# Altium schematic sheet E-01-MB.SchDoc: E-01-MB
size A4; DrawnBy: Wahyu Mahardika; Engineer: Wahyu Mahardika; Organization: EPROM; Address1: Teknik Elektro; Address2: PNUP; Address3: Makassar; Address4: Indonesia; DocumentNumber: 1; Revision: 1
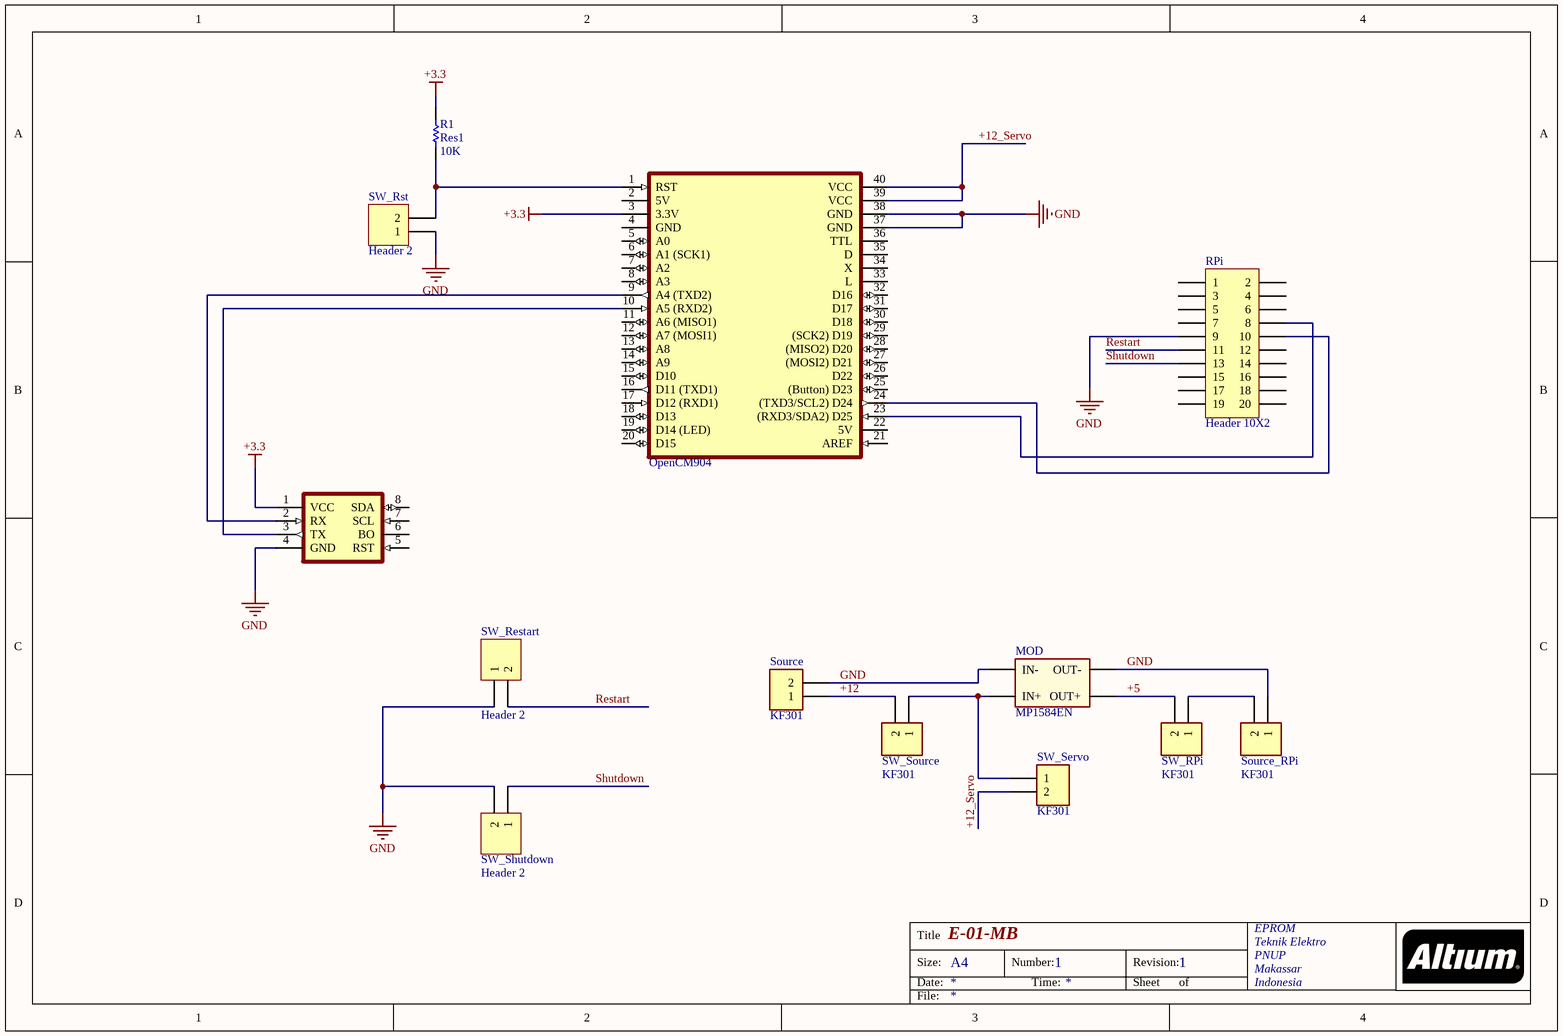
[diagram p0: E-01-MB.SchDoc]

## Parts
GY-Sensor  GY25  [GY25]  (value not drawn)
Main  OpenCM904  [OpenCM904-DIP40]
MOD  MP1584EN  [PCBComponent_1]
R1  Res1  value 10K  [AXIAL-0.3]
RPi  Header 10X2  [HDR2X10]
Source  KF301  [KF301]
Source_RPi  KF301  [KF301]
SW_Restart  Header 2  [HDR1X2]
SW_RPi  KF301  [KF301]
SW_Rst  Header 2  [HDR1X2]
SW_Servo  KF301  [KF301]
SW_Shutdown  Header 2  [HDR1X2]
SW_Source  KF301  [KF301]

## Nets
+3.3: GY-Sensor.1(VCC) Main.3(3.3V) R1.2
GND: GY-Sensor.4(GND) Main.37(GND) Main.38(GND) MOD.1(IN-) MOD.3(OUT-) RPi.9 Source.2 Source_RPi.1 SW_Restart.1 SW_Rst.1 SW_Shutdown.2
+5: MOD.4(OUT+) SW_RPi.2
+12: Source.1 SW_Source.2
+12_Servo: Main.39(VCC) Main.40(VCC) SW_Servo.2
Restart: RPi.11 SW_Restart.2
Shutdown: RPi.13 SW_Shutdown.1
NetGY-Sensor_2: GY-Sensor.2(RX) Main.9(A4_(TXD2))
NetGY-Sensor_3: GY-Sensor.3(TX) Main.10(A5_(RXD2))
NetMain_1: Main.1(RST) R1.1 SW_Rst.2
NetMain_23: Main.23((RXD3/SDA2)_D25) RPi.8
NetMain_24: Main.24((TXD3/SCL2)_D24) RPi.10
NetMOD_2: MOD.2(IN+) SW_Servo.1 SW_Source.1
NetSource_RPi_2: Source_RPi.2 SW_RPi.1

Not connected (* = marked no-connect by the designer): GY-Sensor 5(RST) 6(BO) 7(SCL) 8(SDA); Main 2(5V) 4(GND) 5(A0) 6(A1_(SCK1)) 7(A2) 8(A3) 11(A6_(MISO1)) 12(A7_(MOSI1)) 13(A8) 14(A9) 15(D10) 16(D11_(TXD1)) 17(D12_(RXD1)) 18(D13) 19(D14_(LED)) 20(D15) 21(AREF) 22(5V) 25((Button)_D23) 26(D22) 27((MOSI2)_D21) 28((MISO2)_D20) 29((SCK2)_D19) 30(D18) 31(D17) 32(D16) 33(L) 34(X) 35(D) 36(TTL); RPi 1 2 3 4 5 6 7 12 14 15 16 17 18 19 20

## Notes on the sheet
- Title
- Size:
- Date:
- A4
- Number:
- Time:
- Revision:
- Sheet
- of
- File:

## Library data of the parts
R1 = Res1: Resistor; Published: 8-Jun-2000; LatestRevisionDate: 17-Jul-2002; LatestRevisionNote: Re-released for DXP Platform.; PackageReference: AXIAL-0.3; Publisher: Altium Limited; PackageDescription: Axial Device, Thru-Hole; 2 Leads; 0.3 in Pin Spacing
RPi = Header 10X2: Header, 10-Pin, Dual row; LatestRevisionDate: 17-Jul-2002; LatestRevisionNote: Re-released for DXP Platform.; Publisher: Altium Limited
SW_Restart SW_Rst SW_Shutdown = Header 2: Header, 2-Pin; LatestRevisionDate: 17-Jul-2002; LatestRevisionNote: Re-released for DXP Platform.; Publisher: Altium Limited